# Altium schematic sheet ModuleDieuKhienNguoiDung.SchDoc
size A
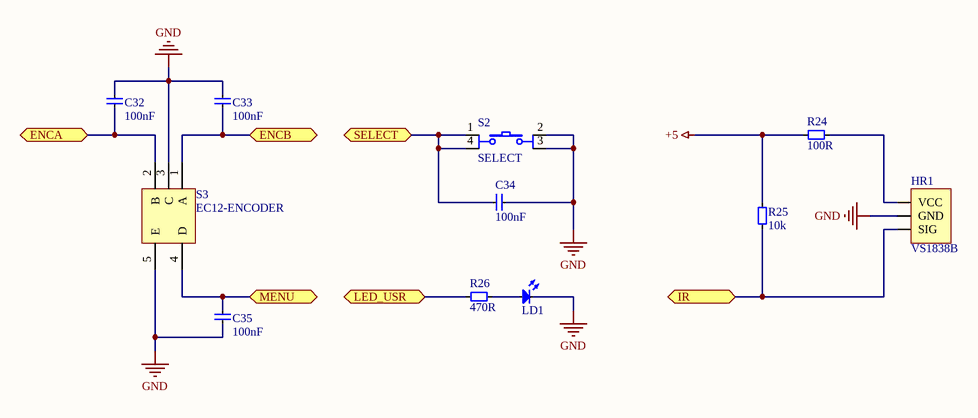
[diagram p0: ModuleDieuKhienNguoiDung.SchDoc]

## Parts
C32  100nF  [C-0805]
C33  100nF  [C-0805]
C34  100nF  [C-0805]
C35  100nF  [C-0805]
HR1  VS1838B  [VS1838B-A]
LD1  USR  [LED-0805-RED]  (value not drawn)
R24  100R  [R-0805]
R25  10k  [R-0805]
R26  470R  [R-0805]
S2  SELECT  [SW4P-DIP-6X6MM]
S3  EC12-ENCODER  [EC12-ENCODER]

## Ports
ENCA (bidir), ENCB (bidir), IR (bidir), LED_USR (bidir), MENU (bidir), SELECT (bidir)

## Nets
+5: R24.2 R25.2
GND: C32.2 C33.2 C34.2 C35.2 HR1.2(GND) LD1.2 S2.2 S2.3 S3.3(C) S3.5(E)
ENCA: C32.1 S3.2(B) ; port ENCA
ENCB: C33.1 S3.1(A) ; port ENCB
IR: HR1.1(SIG) R25.1 ; port IR
LED_USR: R26.1 ; port LED_USR
MENU: C35.1 S3.4(D) ; port MENU
SELECT: C34.1 S2.1 S2.4 ; port SELECT
NetHR1_3: HR1.3(VCC) R24.1
NetLD1_1: LD1.1 R26.2

## Library data of the parts
C32-C35 = CAP: Cac Loai Tu Khong Phan Cuc
HR1 = VS1838B: Module Giai Ma IR
LD1 = LED: Cac Loai LED Don
R24-R26 = RES: Cac Loai Dien Tro
S2 = SW4P-DIP-6X6MM: Nut Nhan 4 Chan 6X6MM
S3 = EC12-ENCODER: Encoder Xoay Vo Cap Co Nut Nhan